# EasyEDA schematic SCH_Octacon_Pico2.json
TITLE: Pico 2; REV: 1.0; Date: 2025-04-18; Sheet: 1/1; Drawn By: Stefan Sauer; Company: Ensonic
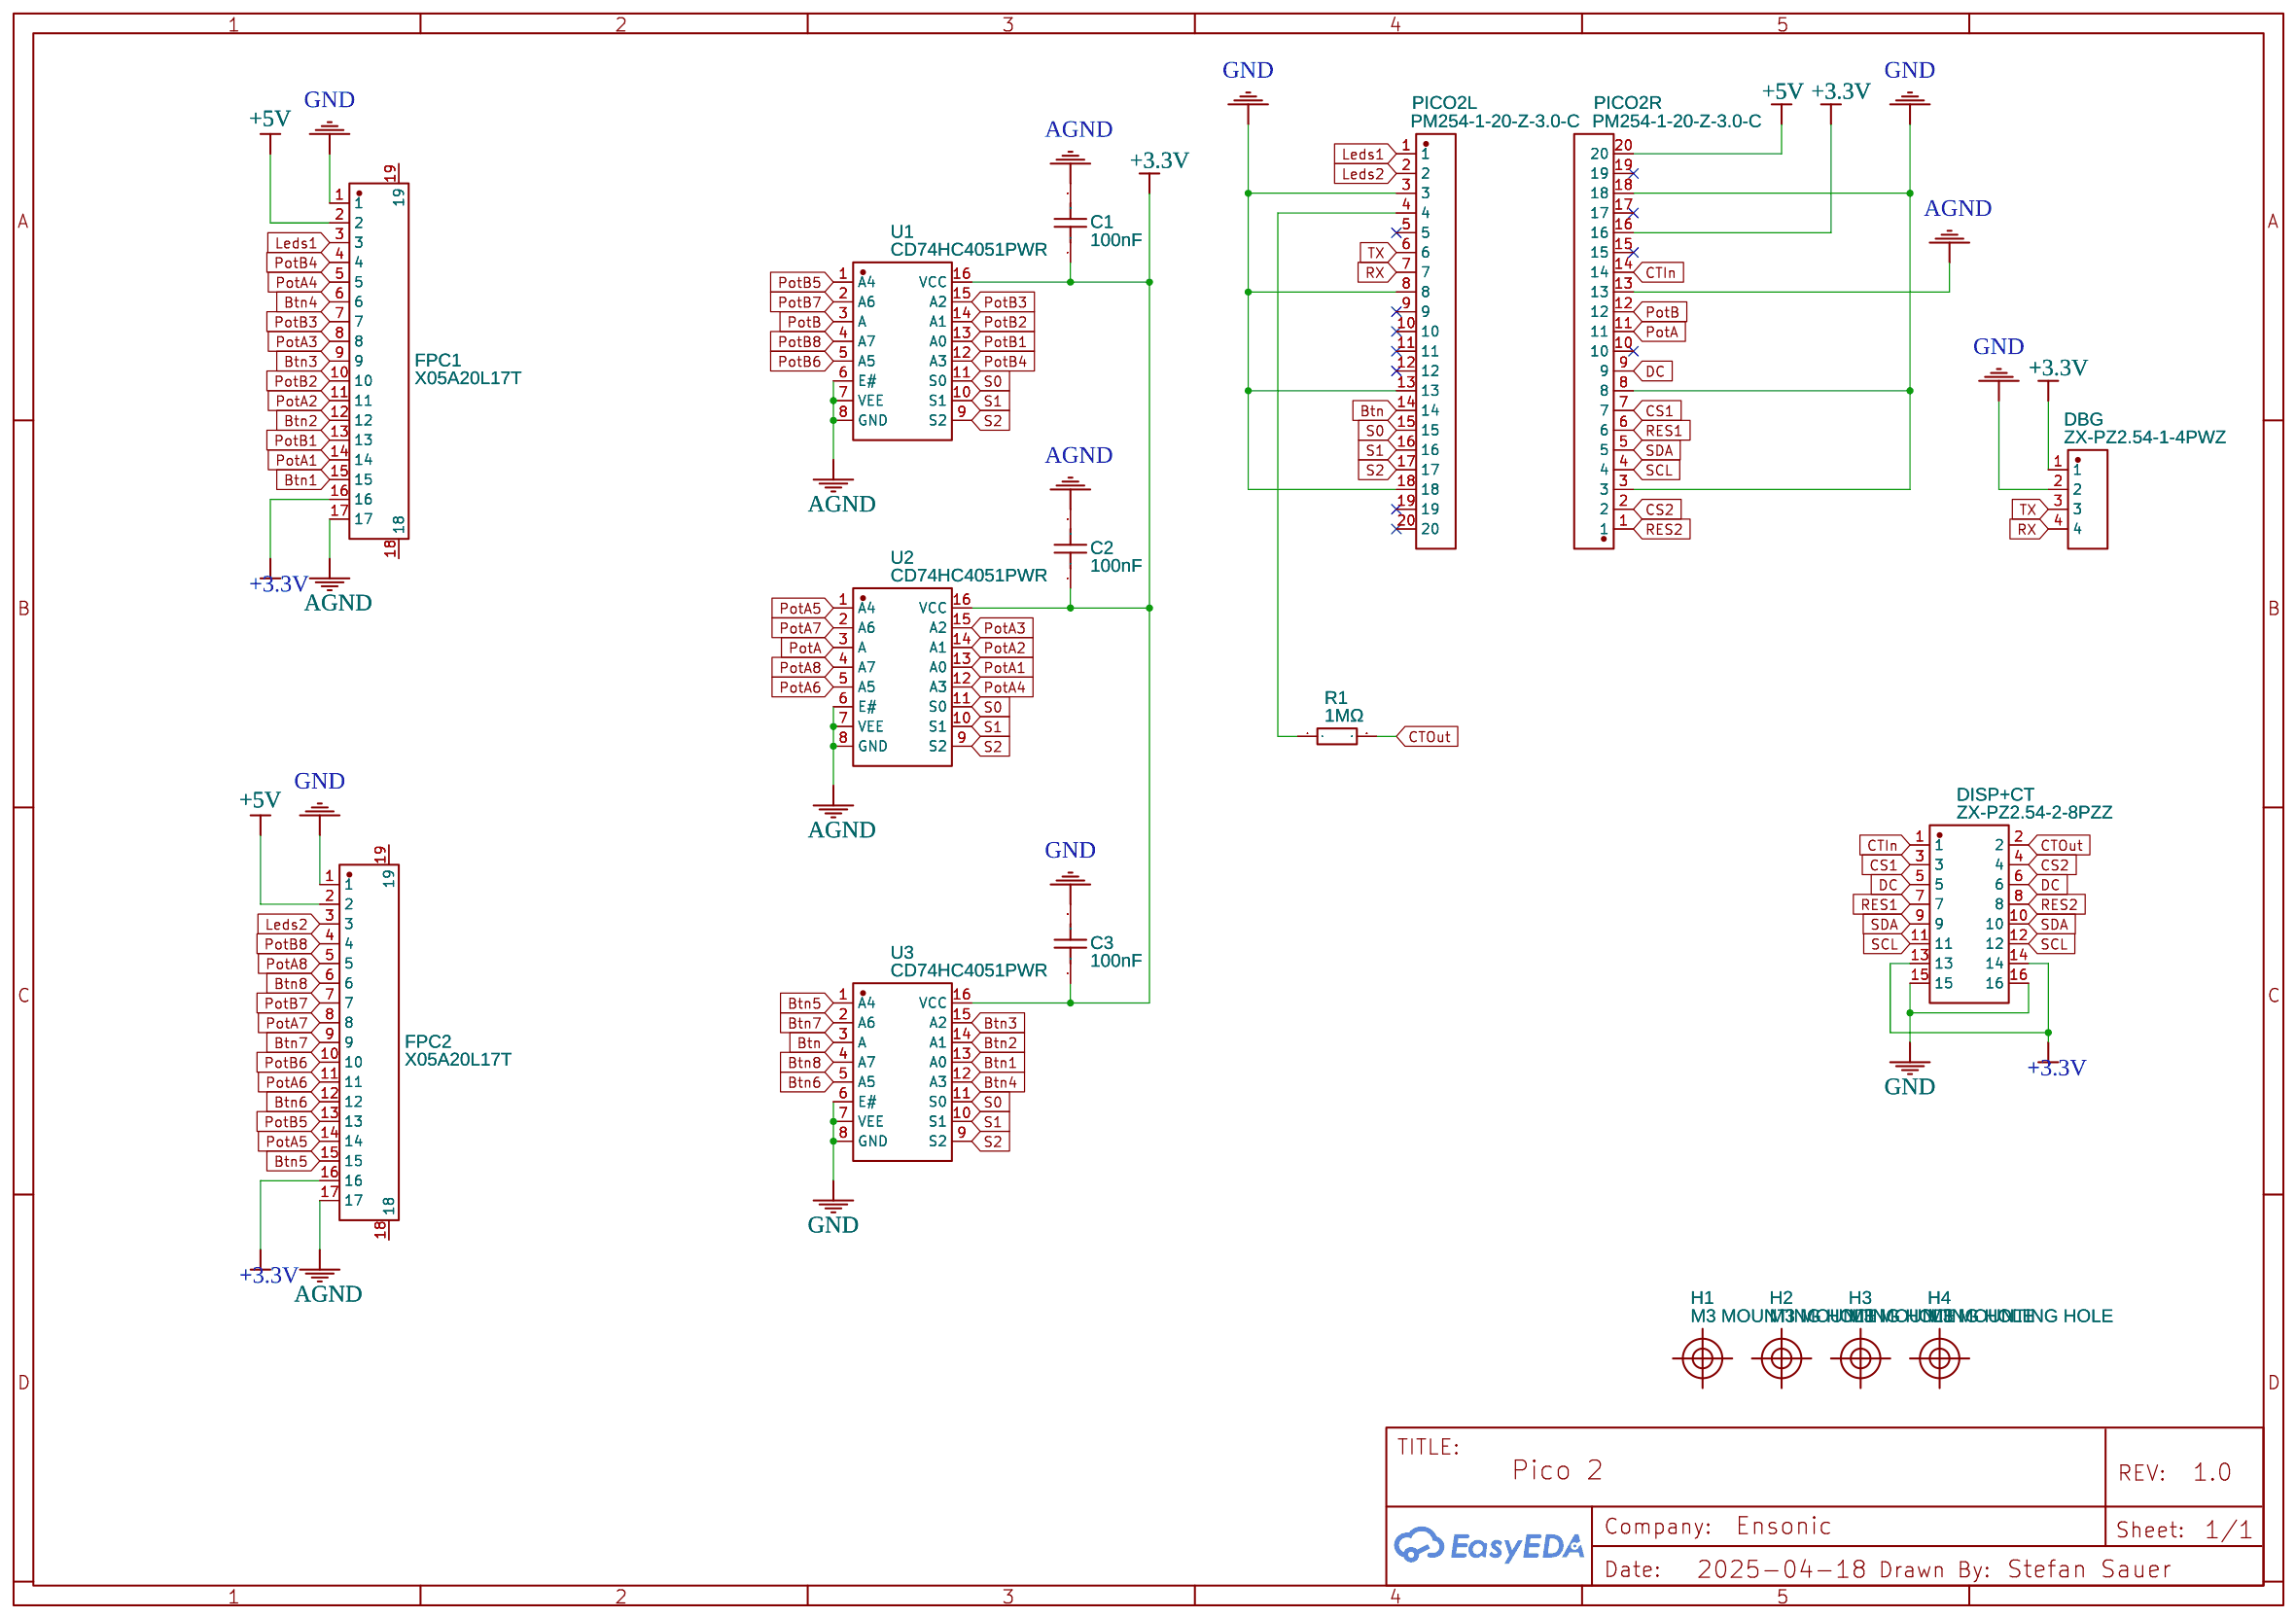
[diagram p0: schematic sheet]

## Parts
C1  100nF  [C0402]
C2  100nF  [C0402]
C3  100nF  [C0402]
DBG  ZX-PZ2.54-1-4PWZ  [HDR-TH_4P-P2.54-H-M-W10.3]
DISP+CT  ZX-PZ2.54-2-8PZZ  [HDR-TH_16P-P2.54-V-M-R2-C8-S2.54]
FPC1  X05A20L17T  [FFC-SMD_X05A20L17T]
FPC2  X05A20L17T  [FFC-SMD_X05A20L17T]
H1  M3 MOUNTING HOLE  [MOUNTINGHOLE:MOUNTINGHOLE_3.2MM_M3]
H2  M3 MOUNTING HOLE  [MOUNTINGHOLE:MOUNTINGHOLE_3.2MM_M3]
H3  M3 MOUNTING HOLE  [MOUNTINGHOLE:MOUNTINGHOLE_3.2MM_M3]
H4  M3 MOUNTING HOLE  [MOUNTINGHOLE:MOUNTINGHOLE_3.2MM_M3]
PICO2L  PM254-1-20-Z-3.0-C  [HDR-TH_20P-P2.54-V-F_5]
PICO2R  PM254-1-20-Z-3.0-C  [HDR-TH_20P-P2.54-V-F_5]
R1  1MΩ  [R0805]
U1  CD74HC4051PWR  [TSSOP-16_L5.0-W4.4-P0.65-LS6.4-BL]
U2  CD74HC4051PWR  [TSSOP-16_L5.0-W4.4-P0.65-LS6.4-BL]
U3  CD74HC4051PWR  [TSSOP-16_L5.0-W4.4-P0.65-LS6.4-BL]

## Library data of the parts
C1-C3 = CT41G-0402-2X1-16V-0.1μF-K(N): Contributor: LCSC; Supplier: LCSC; Supplier Part: C141382; Manufacturer: TORCH(火炬); JLCPCB Part Class: Extended Part
DBG = ZX-PZ2.54-1-4PWZ: Supplier: LCSC; Supplier Part: C7501292; Manufacturer: Megastar(兆星); Contributor: lcsc; JLCPCB Part Class: Extended Part
DISP+CT = ZX-PZ2.54-2-8PZZ: Supplier: LCSC; Supplier Part: C7501279; Manufacturer: Megastar(兆星); Contributor: lcsc; JLCPCB Part Class: Extended Part
FPC1 FPC2 = X05A20L17T: Contributor: LCSC; Supplier: LCSC; Supplier Part: C388672; Manufacturer: XKB Connection(中国星坤); JLCPCB Part Class: Extended Part
H1-H4 = M3 MOUNTING HOLE: Manufacturer Part: M3 Mounting Hole; link: This is a 3.125mm mounting hole; Contributor: dynamicdave15
PICO2L PICO2R = PM254-1-20-Z-3.0-C: Contributor: lcsc; Supplier: LCSC; Supplier Part: C5159947; Manufacturer: HCTL(华灿天禄); JLCPCB Part Class: Extended Part
R1 = 0805W8F1004T5E: Supplier: LCSC; Manufacturer: UNI-ROYAL(厚声); Supplier Part: C17514; JLCPCB Part Class: Basic Part
U1-U3 = CD74HC4051PWR: Contributor: LCSC; Supplier: LCSC; Supplier Part: C352826; Manufacturer: TI(德州仪器); JLCPCB Part Class: Extended Part

## Nets
+3.3V: C1.1 C2.1 C3.1 DBG.1 DISP+CT.13 DISP+CT.14 FPC1.16 FPC2.16 PICO2R.16 U1.16(VCC) U2.16(VCC) U3.16(VCC)
+5V: FPC1.2 FPC2.2 PICO2R.20
AGND: C1.2 C2.2 FPC1.17 FPC2.17 PICO2R.13 U1.6(E#) U1.7(VEE) U1.8(GND) U2.6(E#) U2.7(VEE) U2.8(GND)
GND: C3.2 DBG.2 DISP+CT.15 DISP+CT.16 FPC1.1 FPC2.1 PICO2L.3 PICO2L.8 PICO2L.13 PICO2L.18 PICO2R.3 PICO2R.8 PICO2R.18 U3.6(E#) U3.7(VEE) U3.8(GND)
Btn: PICO2L.14 U3.3(A)
Btn1: FPC1.15 U3.13(A0)
Btn2: FPC1.12 U3.14(A1)
Btn3: FPC1.9 U3.15(A2)
Btn4: FPC1.6 U3.12(A3)
Btn5: FPC2.15 U3.1(A4)
Btn6: FPC2.12 U3.5(A5)
Btn7: FPC2.9 U3.2(A6)
Btn8: FPC2.6 U3.4(A7)
CS1: DISP+CT.3 PICO2R.7
CS2: DISP+CT.4 PICO2R.2
CTIn: DISP+CT.1 PICO2R.14
CTOut: DISP+CT.2 R1.2
DC: DISP+CT.5 DISP+CT.6 PICO2R.9
Leds1: FPC1.3 PICO2L.1
Leds2: FPC2.3 PICO2L.2
PotA: PICO2R.11 U2.3(A)
PotA1: FPC1.14 U2.13(A0)
PotA2: FPC1.11 U2.14(A1)
PotA3: FPC1.8 U2.15(A2)
PotA4: FPC1.5 U2.12(A3)
PotA5: FPC2.14 U2.1(A4)
PotA6: FPC2.11 U2.5(A5)
PotA7: FPC2.8 U2.2(A6)
PotA8: FPC2.5 U2.4(A7)
PotB: PICO2R.12 U1.3(A)
PotB1: FPC1.13 U1.13(A0)
PotB2: FPC1.10 U1.14(A1)
PotB3: FPC1.7 U1.15(A2)
PotB4: FPC1.4 U1.12(A3)
PotB5: FPC2.13 U1.1(A4)
PotB6: FPC2.10 U1.5(A5)
PotB7: FPC2.7 U1.2(A6)
PotB8: FPC2.4 U1.4(A7)
RES1: DISP+CT.7 PICO2R.6
RES2: DISP+CT.8 PICO2R.1
RX: DBG.4 PICO2L.7
S0: PICO2L.15 U1.11(S0) U2.11(S0) U3.11(S0)
S1: PICO2L.16 U1.10(S1) U2.10(S1) U3.10(S1)
S2: PICO2L.17 U1.9(S2) U2.9(S2) U3.9(S2)
SCL: DISP+CT.11 DISP+CT.12 PICO2R.4
SDA: DISP+CT.9 DISP+CT.10 PICO2R.5
TX: DBG.3 PICO2L.6
Net-(PICO2L-4): PICO2L.4 R1.1

Not connected (* = marked no-connect by the designer): FPC1 18 19; FPC2 18 19; PICO2L 5* 9* 10* 11* 12* 19* 20*; PICO2R 10* 15* 17* 19*
